# Altium schematic sheet STEMMA.SchDoc
size Letter; Author: FF7 HD Remastered
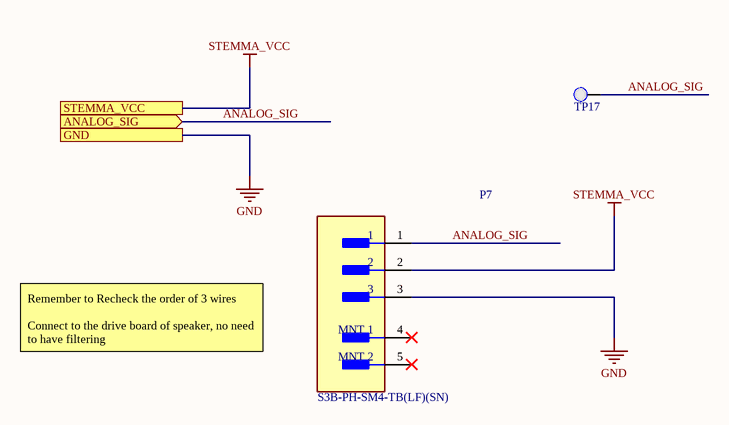
[diagram p0: STEMMA.SchDoc]

## Parts
P7  S3B-PH-SM4-TB(LF)(SN)  [FP-S3B-PH-SM4-TB_LF_SN-MFG]
TP17  Test Point 0.1"  [Test Point 0.1"-Footprint-1]  (value not drawn)  (no BOM)

## Ports
ANALOG_SIG (in), GND, STEMMA_VCC

## Nets
GND: P7.3 ; port GND
STEMMA_VCC: P7.2 ; port STEMMA_VCC
ANALOG_SIG: P7.1 TP17.1(PAD) ; port ANALOG_SIG

Not connected (* = marked no-connect by the designer): P7 4(MNT_1)* 5(MNT_2)*

## Notes on the sheet
- Remember to Recheck the order of 3 wires
  Connect to the drive board of speaker, no need to have filtering
- Title:
- Desc:
- Size:
- Letter
- Auth:
- Proj:
- Sheet
- of
- www.seas.upenn.edu
- Electrical and Systems Engineering

## Library data of the parts
P7 = CMP-2000-07023-2: CONN HEADER SMD R/A 3POS 2MM; Current Rating: 2A; Voltage Rating: 100V; Gender: Male; Number of Contacts: 3; Insulation Resistance: 1GR; Contact Resistance: 10mR; Termination: Solder; Orientation: Right Angle; Pitch: 2mm; Insulation Color: Natural; Flammability Rating: UL94 V-0; Width: 5mm; Max Current Rating: 2A; Lead Free: Lead Free; Mount: Surface Mount; Max Operating Temperature: 85°C; Connector Type: Header; Fastening Type: Detent; Max Voltage Rating (DC): 100V; Housing Material: Polyamide; Number of Rows: 1; Housing Color: Beige; Contact Plating: Tin; Contact Shape: Square; Working Voltage: 100V; Contact Material: Copper Alloy; Contact Mating Length: 0.13inch; Contact Type: Male Pin; Max Voltage Rating (AC): 100V; Packaging: Tape and Reel; Min Operating Temperature: -25°C; Number of Positions: 3; REACH SVHC: No SVHC; Contact Finish - Mating: TIN; Color: Natural; Length: 9.9mm; Insulation Material: Nylon; Depth: 7.6mm; Material: Polyamide; Voltage Rating (AC): 100V; Series: PH; Height: 9.4mm; Number of Poles: 3; Lead Pitch: 2mm
TP17 = CMP-00086-1